# EAGLE schematic RPi-DPI-HAT_v10 (EAGLE 7.3.0)
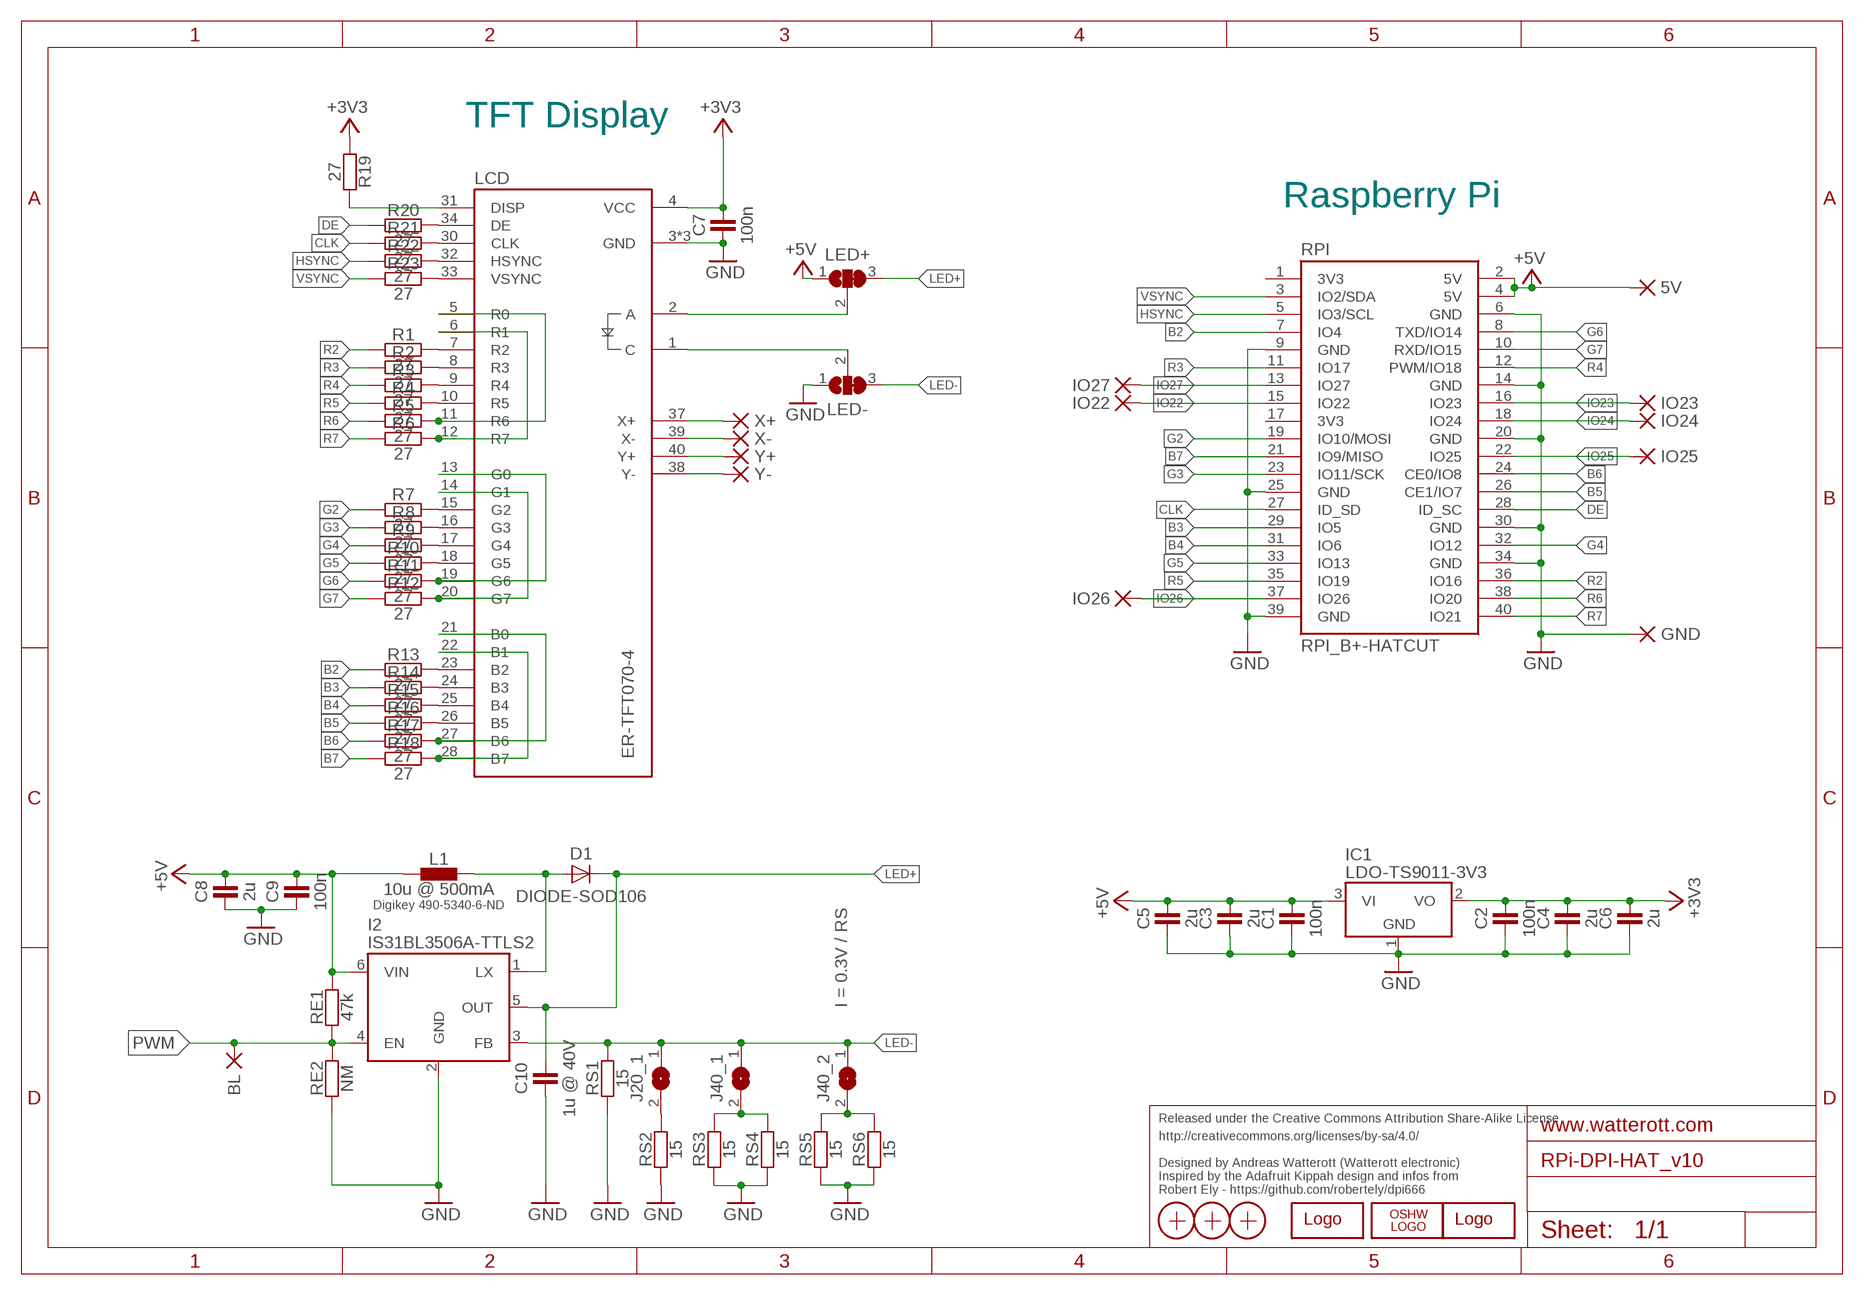
[diagram p0: schematic, sheet 1]

## Parts
5V  PAD-0.80X1.60_NC  [PAD-0.80X1.60_NC]
BL  PAD-0.80X1.60_NC  [PAD-0.80X1.60_NC]
C1  100n  CAPACITOR-0402  [C0402]
C2  100n  CAPACITOR-0402  [C0402]
C3  2u  CAPACITOR-0402  [C0402]
C4  2u  CAPACITOR-0402  [C0402]
C5  2u  CAPACITOR-0402  [C0402]
C6  2u  CAPACITOR-0402  [C0402]
C7  100n  CAPACITOR-0402  [C0402]
C8  2u  CAPACITOR-0402  [C0402]
C9  100n  CAPACITOR-0402  [C0402]
C10  1u @ 40V  CAPACITOR-0805  [C0805]
D1  DIODE-SOD106  [SOD106]
GND  PAD-0.80X1.60_NC  [PAD-0.80X1.60_NC]
I2  IS31BL3506A-TTLS2  [SOT23-6]
IC1  LDO-TS9011-3V3  [SOT23]
IO22  PAD-0.80X1.60_NC  [PAD-0.80X1.60_NC]
IO23  PAD-0.80X1.60_NC  [PAD-0.80X1.60_NC]
IO24  PAD-0.80X1.60_NC  [PAD-0.80X1.60_NC]
IO25  PAD-0.80X1.60_NC  [PAD-0.80X1.60_NC]
IO26  PAD-0.80X1.60_NC  [PAD-0.80X1.60_NC]
IO27  PAD-0.80X1.60_NC  [PAD-0.80X1.60_NC]
J20_1  JUMPER2-0402  [JUMPER2-0402]
J40_1  JUMPER2-0402  [JUMPER2-0402]
J40_2  JUMPER2-0402  [JUMPER2-0402]
L1  10u @ 500mA  INDUCTOR-1212  [L_1212]
LCD  ER-TFT070-4  [FPC40]
LED+  JUMPER3-0603-NC  [JUMPER3-0603_NC]
LED-  JUMPER3-0603-NC  [JUMPER3-0603_NC]
LOGO1  LOGO-S_PLACE_S  [SPARK_TPLACE_S]
LOGO2  OSHW_LOGOX0070  [OSHW_6X70]
LOGO3  LOGO-PLACE  [LOGO_TPLACE]
R1  27  RESISTOR-0402  [C0402]
R2  27  RESISTOR-0402  [C0402]
R3  27  RESISTOR-0402  [C0402]
R4  27  RESISTOR-0402  [C0402]
R5  27  RESISTOR-0402  [C0402]
R6  27  RESISTOR-0402  [C0402]
R7  27  RESISTOR-0402  [C0402]
R8  27  RESISTOR-0402  [C0402]
R9  27  RESISTOR-0402  [C0402]
R10  27  RESISTOR-0402  [C0402]
R11  27  RESISTOR-0402  [C0402]
R12  27  RESISTOR-0402  [C0402]
R13  27  RESISTOR-0402  [C0402]
R14  27  RESISTOR-0402  [C0402]
R15  27  RESISTOR-0402  [C0402]
R16  27  RESISTOR-0402  [C0402]
R17  27  RESISTOR-0402  [C0402]
R18  27  RESISTOR-0402  [C0402]
R19  27  RESISTOR-0402  [C0402]
R20  27  RESISTOR-0402  [C0402]
R21  27  RESISTOR-0402  [C0402]
R22  27  RESISTOR-0402  [C0402]
R23  27  RESISTOR-0402  [C0402]
RE1  47k  RESISTOR-0402  [C0402]
RE2  NM  RESISTOR-0402  [C0402]
RPI  RPI_B+-HATCUT  [RPI-B+HAT_CUTOUT]
RS1  15  RESISTOR-0402  [C0402]
RS2  15  RESISTOR-0402  [C0402]
RS3  15  RESISTOR-0402  [C0402]
RS4  15  RESISTOR-0402  [C0402]
RS5  15  RESISTOR-0402  [C0402]
RS6  15  RESISTOR-0402  [C0402]
X1  PASSER-07  [PASSER_07MM]
X2  PASSER-07  [PASSER_07MM]
X3  PASSER-07  [PASSER_07MM]
X+  PAD-0.80X1.60_NC  [PAD-0.80X1.60_NC]
X-  PAD-0.80X1.60_NC  [PAD-0.80X1.60_NC]
Y+  PAD-0.80X1.60_NC  [PAD-0.80X1.60_NC]
Y-  PAD-0.80X1.60_NC  [PAD-0.80X1.60_NC]

## Nets
+3V3: C2.2 C4.2 C6.2 C7.2 IC1.2(VO) LCD.4(VCC) R19.1
+5V: 5V.1(P) C1.2 C3.2 C5.2 C8.2 C9.2 I2.6(VIN) IC1.3(VI) L1.1 LED+.1 RE1.2 RPI.2(5V) RPI.4(5V)
A: LCD.2(A) LED+.2
B2: R13.1 RPI.7(IO4)
B3: R14.1 RPI.29(IO5)
B4: R15.1 RPI.31(IO6)
B5: R16.1 RPI.26(CE1/IO7)
B6: R17.1 RPI.24(CE0/IO8)
B7: R18.1 RPI.21(IO9/MISO)
C: LCD.1(C) LED-.2
CLK: R21.1 RPI.27(ID_SD)
DE: R20.1 RPI.28(ID_SC)
G2: R7.1 RPI.19(IO10/MOSI)
G3: R8.1 RPI.23(IO11/SCK)
G4: R9.1 RPI.32(IO12)
G5: R10.1 RPI.33(IO13)
G6: R11.1 RPI.8(TXD/IO14)
G7: R12.1 RPI.10(RXD/IO15)
GND: C1.1 C2.1 C3.1 C4.1 C5.1 C6.1 C7.1 C8.1 C9.1 C10.1 GND.1(P) I2.2(GND) IC1.1(GND) LCD.3(GND) LCD.29(GND) LCD.36(GND) LED-.1 RE2.1 RPI.6(GND) RPI.9(GND) RPI.14(GND) RPI.20(GND) RPI.25(GND) RPI.30(GND) RPI.34(GND) RPI.39(GND) RS1.1 RS2.1 RS3.1 RS4.1 RS5.1 RS6.1
HSYNC: R22.1 RPI.5(IO3/SCL)
IO22: IO22.1(P) RPI.15(IO22)
IO23: IO23.1(P) RPI.16(IO23)
IO24: IO24.1(P) RPI.18(IO24)
IO25: IO25.1(P) RPI.22(IO25)
IO26: IO26.1(P) RPI.37(IO26)
IO27: IO27.1(P) RPI.13(IO27)
LED+: C10.2 D1.C I2.5(OUT) LED+.3
LED-: I2.3(FB) J20_1.1 J40_1.1 J40_2.1 LED-.3 RS1.2
LX: D1.A I2.1(LX) L1.2
N$1: J40_1.2 RS3.2 RS4.2
N$2: J20_1.2 RS2.2
N$3: LCD.7(R2) R1.2
N$4: LCD.5(R0) LCD.11(R6) R5.2
N$7: J40_2.2 RS5.2 RS6.2
N$8: LCD.6(R1) LCD.12(R7) R6.2
N$9: LCD.8(R3) R2.2
N$10: LCD.9(R4) R3.2
N$11: LCD.10(R5) R4.2
N$12: LCD.15(G2) R7.2
N$13: LCD.16(G3) R8.2
N$14: LCD.17(G4) R9.2
N$16: LCD.18(G5) R10.2
N$17: LCD.13(G0) LCD.19(G6) R11.2
N$18: LCD.14(G1) LCD.20(G7) R12.2
N$19: LCD.23(B2) R13.2
N$20: LCD.24(B3) R14.2
N$21: LCD.25(B4) R15.2
N$25: LCD.26(B5) R16.2
N$26: LCD.21(B0) LCD.27(B6) R17.2
N$27: LCD.22(B1) LCD.28(B7) R18.2
N$32: LCD.31(DISP) R19.2
N$33: LCD.34(DE) R20.2
N$34: LCD.30(CLK) R21.2
N$35: LCD.32(HSYNC) R22.2
N$36: LCD.33(VSYNC) R23.2
PWM: BL.1(P) I2.4(EN) RE1.1 RE2.2
R2: R1.1 RPI.36(IO16)
R3: R2.1 RPI.11(IO17)
R4: R3.1 RPI.12(PWM/IO18)
R5: R4.1 RPI.35(IO19)
R6: R5.1 RPI.38(IO20)
R7: R6.1 RPI.40(IO21)
VSYNC: R23.1 RPI.3(IO2/SDA)
X+: LCD.37(X+) X+.1(P)
X-: LCD.39(X-) X-.1(P)
Y+: LCD.40(Y+) Y+.1(P)
Y-: LCD.38(Y-) Y-.1(P)
Unconnected: RPI.1(3V3) RPI.17(3V3)

## Notes on the sheet
- TFT Display
- Raspberry Pi
- Digikey 490-5340-6-ND
- I = 0.3V / RS
- Released under the Creative Commons Attribution Share-Alike License
- http://creativecommons.org/licenses/by-sa/4.0/
- Designed by Andreas Watterott (Watterott electronic)
- Inspired by the Adafruit Kippah design and infos from 
  Robert Ely - https://github.com/robertely/dpi666

## Library data of the parts
5V BL GND IO22-IO27 X+ X- Y+ Y- = we-rcl:PAD: Pads
C1-C10 = we-rcl:CAPACITOR: Capacitors ...4.7uF @ 6.3V -> 0402 ...10uF @ 16V -> 0603 ...22uF @ 25V -> 0805
D1 = we-rcl:DIODE: Diodes
I2 = we-power:IS31BL3506A: ISSI IS31BL3506A Boost Converter for LED Backlight Input: 2.7...5V Output: up to 35V 300mV Feedback Voltage; DIGIKEY: 706-1213-6-ND
IC1 = we-power:LDO: LDOs TS1117 800mA, Vin max 12V - compatible NCP1117 1A, Vin max 20V TS9011 250mA, Vin max 12V - compatible AP2210 300mA, Vin max 15V TS5204 150mA, Vin max 16V
J20_1 J40_1 J40_2 = we-rcl:JUMPER2: 2 Pin Jumpers
L1 = we-power:INDUCTOR: Power Inductors
LCD = we-opto:ER-TFT: ER Displays TFT043-3 - 4.3" 480x272 (LED 15mA @ 25.0V) TFT050-3 - 5.0" 800x480 (LED @ 40mA @ 19.2V) TFT070-4 - 7.0" 800x480 (LED @ 40mA @ 20.4V)
LED+ LED- = we-rcl:JUMPER3: 3 Pin Jumpers
LOGO1 LOGO3 = we-symbol:LOGO: Watterott electronic Logo
LOGO2 = we-symbol:OSHW_LOGO: Open-Source-Hardware Logo
R1-R23 RE1 RE2 RS1-RS6 = we-rcl:RESISTOR: Resistors all kinds in 0603 and 0402
RPI = we-board:RPI_B+: Raspberry Pi Model B+
X1-X3 = we-symbol:PASSER: Fiducial Markers